# Altium schematic sheet cSLIM-SA_FRAM.SchDoc
size 297 x 210 mm; SheetNumber: 11
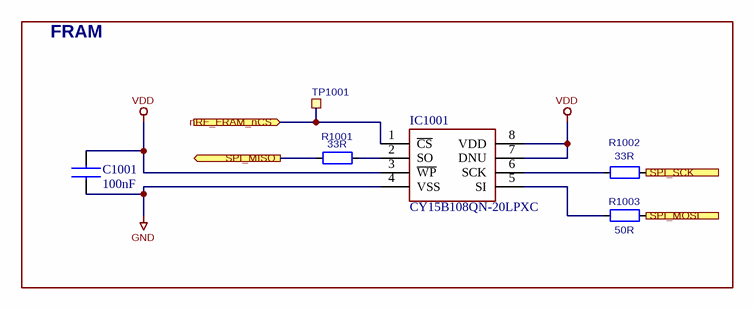
[diagram p0: cSLIM-SA_FRAM.SchDoc]

## Parts
C1001  100nF  [CAPC1608X90N]
IC1001  CY15B108QN-20LPXC  [SON65P323X328X55-8N]
R1001  33R  [RESC1608X55N]
R1002  33R  [RESC1608X55N]
R1003  50R  [RESC1608X55N]
TP1001  (no value)  [TP_SMD_Ø1.0mm]  (no BOM)

## Blocks framed on the sheet
FRAM: C1001 IC1001 R1001-R1003 TP1001

## Ports
nRF_FRAM_nCS (in), SPI_MISO (out), SPI_MOSI (in), SPI_SCK (in)

## Nets
GND: C1001.2 IC1001.4(VSS)
VDD: C1001.1 IC1001.3(~{WP}) IC1001.7(DNU) IC1001.8(VDD)
nRF_FRAM_nCS: IC1001.1(~{CS}) TP1001.1 ; port nRF_FRAM_nCS
SPI_MISO: R1001.1 ; port SPI_MISO
SPI_MOSI: R1003.1 ; port SPI_MOSI
SPI_SCK: R1002.1 ; port SPI_SCK
NetIC1001_2: IC1001.2(SO) R1001.2
NetIC1001_5: IC1001.5(SI) R1003.2
NetIC1001_6: IC1001.6(SCK) R1002.2

## Notes on the sheet
- 1
- 2
- 3
- 4
- 5
- 6
- A
- B
- C
- Eivind Jølsgard
- D
- Title: cSLIM FRAM
- File: cSLIM_FRAM.sch
- Sheet: /
- NTNU
- KiCad E.D.A.  kicad (5.1.4)-1
- Size: A4
- Date: 2021-03-31
- Rev: v1
- Id: 10/11

## Library data of the parts
C1001 = C: Capacitor; Manufacturer_Name: AVX; Manufacturer_Part_Number: 06033G104ZAT2A; Datasheet Link: http://www.mouser.com/catalog/supplier/library/pdf/AVXSurfaceMountCeramic.pdf; Height: 0.9mm; Mouser Part Number: 581-06033G104Z; Mouser Price/Stock: https://www.mouser.co.uk/ProductDetail/AVX/06033G104ZAT2A?qs=NXubJDmysXJMPmHfVo6Z%252BA%3D%3D; Arrow Part Number: 06033G104ZAT2A; Arrow Price/Stock: https://www.arrow.com/en/products/06033g104zat2a/avx?region=nac
IC1001 = CY15B108QN-20LPXC: Integrated Circuit; Manufacturer_Name: Cypress Semiconductor; Datasheet Link: https://www.arrow.com/en/products/cy15b108qn-20lpxc/cypress-semiconductor; Height: 0.55mm; Manufacturer_Part_Number: CY15B108QN-20LPXC; Mouser Part Number: 727-CY15B108QN20LPXC; Mouser Price/Stock: https://www.mouser.co.uk/ProductDetail/Cypress-Semiconductor/CY15B108QN-20LPXC?qs=P1JMDcb91o5srFPNWUxrEA%3D%3D; Arrow Part Number: CY15B108QN-20LPXC; Arrow Price/Stock: https://www.arrow.com/en/products/cy15b108qn-20lpxc/cypress-semiconductor?region=nac
R1001-R1003 = R
  R1001 R1002: Value: 33R
  R1003: Value: 50R
TP1001 = TP